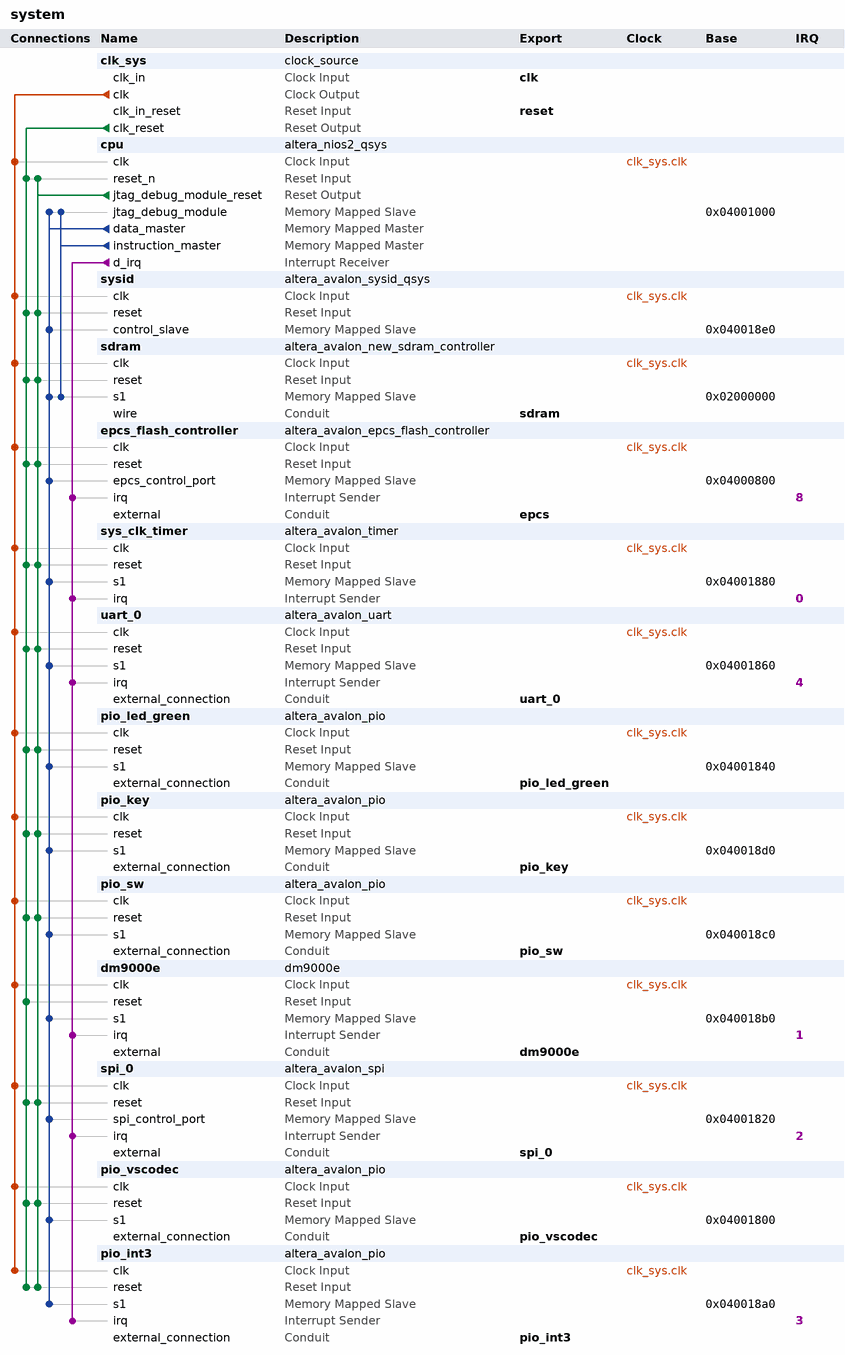
[diagram p0: system contents]
# Platform Designer (Qsys) system system, Cyclone IV E EP4CE22F17C6
# Parameters at their usual value, and those the tool derives, are not listed.
package require -exact qsys 12.1
create_system system
set_project_property DEVICE_FAMILY {Cyclone IV E}
set_project_property DEVICE EP4CE22F17C6

add_instance clk_sys clock_source 12.1
set_instance_parameter_value clk_sys clockFrequency 100000000
set_instance_parameter_value clk_sys resetSynchronousEdges DEASSERT

add_instance cpu altera_nios2_qsys 12.1
set_instance_parameter_value cpu resetSlave sdram.s1
set_instance_parameter_value cpu exceptionSlave sdram.s1
set_instance_parameter_value cpu breakSlave cpu.jtag_debug_module
set_instance_parameter_value cpu impl Fast
set_instance_parameter_value cpu icache_size 8192
set_instance_parameter_value cpu dcache_size 4096

add_instance sysid altera_avalon_sysid_qsys 12.1
set_instance_parameter_value sysid id 0

add_instance sdram altera_avalon_new_sdram_controller 12.1
set_instance_parameter_value sdram TAC 5.5
set_instance_parameter_value sdram TRCD 20.0
set_instance_parameter_value sdram TRP 20.0
set_instance_parameter_value sdram casLatency 3
set_instance_parameter_value sdram columnWidth 9
set_instance_parameter_value sdram dataWidth 16
set_instance_parameter_value sdram generateSimulationModel false
set_instance_parameter_value sdram initRefreshCommands 8
set_instance_parameter_value sdram model custom
set_instance_parameter_value sdram numberOfBanks 4
set_instance_parameter_value sdram numberOfChipSelects 1
set_instance_parameter_value sdram powerUpDelay 200.0
set_instance_parameter_value sdram refreshPeriod 7.8125
set_instance_parameter_value sdram rowWidth 13

add_instance epcs_flash_controller altera_avalon_epcs_flash_controller 12.1

add_instance sys_clk_timer altera_avalon_timer 12.1
set_instance_parameter_value sys_clk_timer period 1
set_instance_parameter_value sys_clk_timer periodUnits MSEC
set_instance_parameter_value sys_clk_timer timerPreset CUSTOM

add_instance uart_0 altera_avalon_uart 12.1
set_instance_parameter_value uart_0 baud 115200
set_instance_parameter_value uart_0 dataBits 8
set_instance_parameter_value uart_0 fixedBaud true
set_instance_parameter_value uart_0 parity NONE
set_instance_parameter_value uart_0 stopBits 1

add_instance pio_led_green altera_avalon_pio 12.1
set_instance_parameter_value pio_led_green bitModifyingOutReg true
set_instance_parameter_value pio_led_green direction Output
set_instance_parameter_value pio_led_green width 7

add_instance pio_key altera_avalon_pio 12.1
set_instance_parameter_value pio_key direction Input
set_instance_parameter_value pio_key simDoTestBenchWiring true
set_instance_parameter_value pio_key width 2

add_instance pio_sw altera_avalon_pio 12.1
set_instance_parameter_value pio_sw direction Input
set_instance_parameter_value pio_sw simDoTestBenchWiring true
set_instance_parameter_value pio_sw width 4

add_instance dm9000e dm9000e 1.2

add_instance spi_0 altera_avalon_spi 12.1
set_instance_parameter_value spi_0 clockPolarity 0
set_instance_parameter_value spi_0 dataWidth 8
set_instance_parameter_value spi_0 masterSPI true
set_instance_parameter_value spi_0 numberOfSlaves 1
set_instance_parameter_value spi_0 targetClockRate 1536000

add_instance pio_vscodec altera_avalon_pio 12.1
set_instance_parameter_value pio_vscodec bitModifyingOutReg true
set_instance_parameter_value pio_vscodec direction Output
set_instance_parameter_value pio_vscodec width 3

add_instance pio_int3 altera_avalon_pio 12.1
set_instance_parameter_value pio_int3 bitClearingEdgeCapReg true
set_instance_parameter_value pio_int3 captureEdge true
set_instance_parameter_value pio_int3 direction Input
set_instance_parameter_value pio_int3 generateIRQ true
set_instance_parameter_value pio_int3 irqType EDGE
set_instance_parameter_value pio_int3 simDoTestBenchWiring true
set_instance_parameter_value pio_int3 width 1

# connections
add_connection clk_sys.clk cpu.clk clock
add_connection clk_sys.clk dm9000e.clk clock
add_connection clk_sys.clk epcs_flash_controller.clk clock
add_connection clk_sys.clk pio_int3.clk clock
add_connection clk_sys.clk pio_key.clk clock
add_connection clk_sys.clk pio_led_green.clk clock
add_connection clk_sys.clk pio_sw.clk clock
add_connection clk_sys.clk pio_vscodec.clk clock
add_connection clk_sys.clk sdram.clk clock
add_connection clk_sys.clk spi_0.clk clock
add_connection clk_sys.clk sys_clk_timer.clk clock
add_connection clk_sys.clk sysid.clk clock
add_connection clk_sys.clk uart_0.clk clock
add_connection clk_sys.clk_reset cpu.reset_n reset
add_connection clk_sys.clk_reset dm9000e.reset reset
add_connection clk_sys.clk_reset epcs_flash_controller.reset reset
add_connection clk_sys.clk_reset pio_int3.reset reset
add_connection clk_sys.clk_reset pio_key.reset reset
add_connection clk_sys.clk_reset pio_led_green.reset reset
add_connection clk_sys.clk_reset pio_sw.reset reset
add_connection clk_sys.clk_reset pio_vscodec.reset reset
add_connection clk_sys.clk_reset sdram.reset reset
add_connection clk_sys.clk_reset spi_0.reset reset
add_connection clk_sys.clk_reset sys_clk_timer.reset reset
add_connection clk_sys.clk_reset sysid.reset reset
add_connection clk_sys.clk_reset uart_0.reset reset
add_connection cpu.jtag_debug_module_reset cpu.reset_n reset
add_connection cpu.jtag_debug_module_reset epcs_flash_controller.reset reset
add_connection cpu.jtag_debug_module_reset pio_int3.reset reset
add_connection cpu.jtag_debug_module_reset pio_key.reset reset
add_connection cpu.jtag_debug_module_reset pio_led_green.reset reset
add_connection cpu.jtag_debug_module_reset pio_sw.reset reset
add_connection cpu.jtag_debug_module_reset pio_vscodec.reset reset
add_connection cpu.jtag_debug_module_reset sdram.reset reset
add_connection cpu.jtag_debug_module_reset spi_0.reset reset
add_connection cpu.jtag_debug_module_reset sys_clk_timer.reset reset
add_connection cpu.jtag_debug_module_reset sysid.reset reset
add_connection cpu.jtag_debug_module_reset uart_0.reset reset
add_connection cpu.data_master cpu.jtag_debug_module avalon
set_connection_parameter_value cpu.data_master/cpu.jtag_debug_module baseAddress 0x04001000
add_connection cpu.data_master dm9000e.s1 avalon
set_connection_parameter_value cpu.data_master/dm9000e.s1 baseAddress 0x040018b0
add_connection cpu.data_master epcs_flash_controller.epcs_control_port avalon
set_connection_parameter_value cpu.data_master/epcs_flash_controller.epcs_control_port baseAddress 0x04000800
add_connection cpu.data_master pio_int3.s1 avalon
set_connection_parameter_value cpu.data_master/pio_int3.s1 baseAddress 0x040018a0
add_connection cpu.data_master pio_key.s1 avalon
set_connection_parameter_value cpu.data_master/pio_key.s1 baseAddress 0x040018d0
add_connection cpu.data_master pio_led_green.s1 avalon
set_connection_parameter_value cpu.data_master/pio_led_green.s1 baseAddress 0x04001840
add_connection cpu.data_master pio_sw.s1 avalon
set_connection_parameter_value cpu.data_master/pio_sw.s1 baseAddress 0x040018c0
add_connection cpu.data_master pio_vscodec.s1 avalon
set_connection_parameter_value cpu.data_master/pio_vscodec.s1 baseAddress 0x04001800
add_connection cpu.data_master sdram.s1 avalon
set_connection_parameter_value cpu.data_master/sdram.s1 baseAddress 0x02000000
add_connection cpu.data_master spi_0.spi_control_port avalon
set_connection_parameter_value cpu.data_master/spi_0.spi_control_port baseAddress 0x04001820
add_connection cpu.data_master sys_clk_timer.s1 avalon
set_connection_parameter_value cpu.data_master/sys_clk_timer.s1 baseAddress 0x04001880
add_connection cpu.data_master sysid.control_slave avalon
set_connection_parameter_value cpu.data_master/sysid.control_slave baseAddress 0x040018e0
add_connection cpu.data_master uart_0.s1 avalon
set_connection_parameter_value cpu.data_master/uart_0.s1 baseAddress 0x04001860
add_connection cpu.instruction_master cpu.jtag_debug_module avalon
set_connection_parameter_value cpu.instruction_master/cpu.jtag_debug_module baseAddress 0x04001000
add_connection cpu.instruction_master sdram.s1 avalon
set_connection_parameter_value cpu.instruction_master/sdram.s1 baseAddress 0x02000000
add_connection cpu.d_irq dm9000e.irq interrupt
set_connection_parameter_value cpu.d_irq/dm9000e.irq irqNumber 1
add_connection cpu.d_irq epcs_flash_controller.irq interrupt
set_connection_parameter_value cpu.d_irq/epcs_flash_controller.irq irqNumber 8
add_connection cpu.d_irq pio_int3.irq interrupt
set_connection_parameter_value cpu.d_irq/pio_int3.irq irqNumber 3
add_connection cpu.d_irq spi_0.irq interrupt
set_connection_parameter_value cpu.d_irq/spi_0.irq irqNumber 2
add_connection cpu.d_irq sys_clk_timer.irq interrupt
set_connection_parameter_value cpu.d_irq/sys_clk_timer.irq irqNumber 0
add_connection cpu.d_irq uart_0.irq interrupt
set_connection_parameter_value cpu.d_irq/uart_0.irq irqNumber 4

# exported interfaces
add_interface clk clock sink
set_interface_property clk EXPORT_OF clk_sys.clk_in
add_interface reset reset sink
set_interface_property reset EXPORT_OF clk_sys.clk_in_reset
add_interface sdram conduit end
set_interface_property sdram EXPORT_OF sdram.wire
add_interface epcs conduit end
set_interface_property epcs EXPORT_OF epcs_flash_controller.external
add_interface uart_0 conduit end
set_interface_property uart_0 EXPORT_OF uart_0.external_connection
add_interface pio_led_green conduit end
set_interface_property pio_led_green EXPORT_OF pio_led_green.external_connection
add_interface pio_key conduit end
set_interface_property pio_key EXPORT_OF pio_key.external_connection
add_interface pio_sw conduit end
set_interface_property pio_sw EXPORT_OF pio_sw.external_connection
add_interface dm9000e conduit end
set_interface_property dm9000e EXPORT_OF dm9000e.external
add_interface spi_0 conduit end
set_interface_property spi_0 EXPORT_OF spi_0.external
add_interface pio_vscodec conduit end
set_interface_property pio_vscodec EXPORT_OF pio_vscodec.external_connection
add_interface pio_int3 conduit end
set_interface_property pio_int3 EXPORT_OF pio_int3.external_connection

save_system system.qsys
